# EAGLE design PiHatV2 (EAGLE 9.6.2)
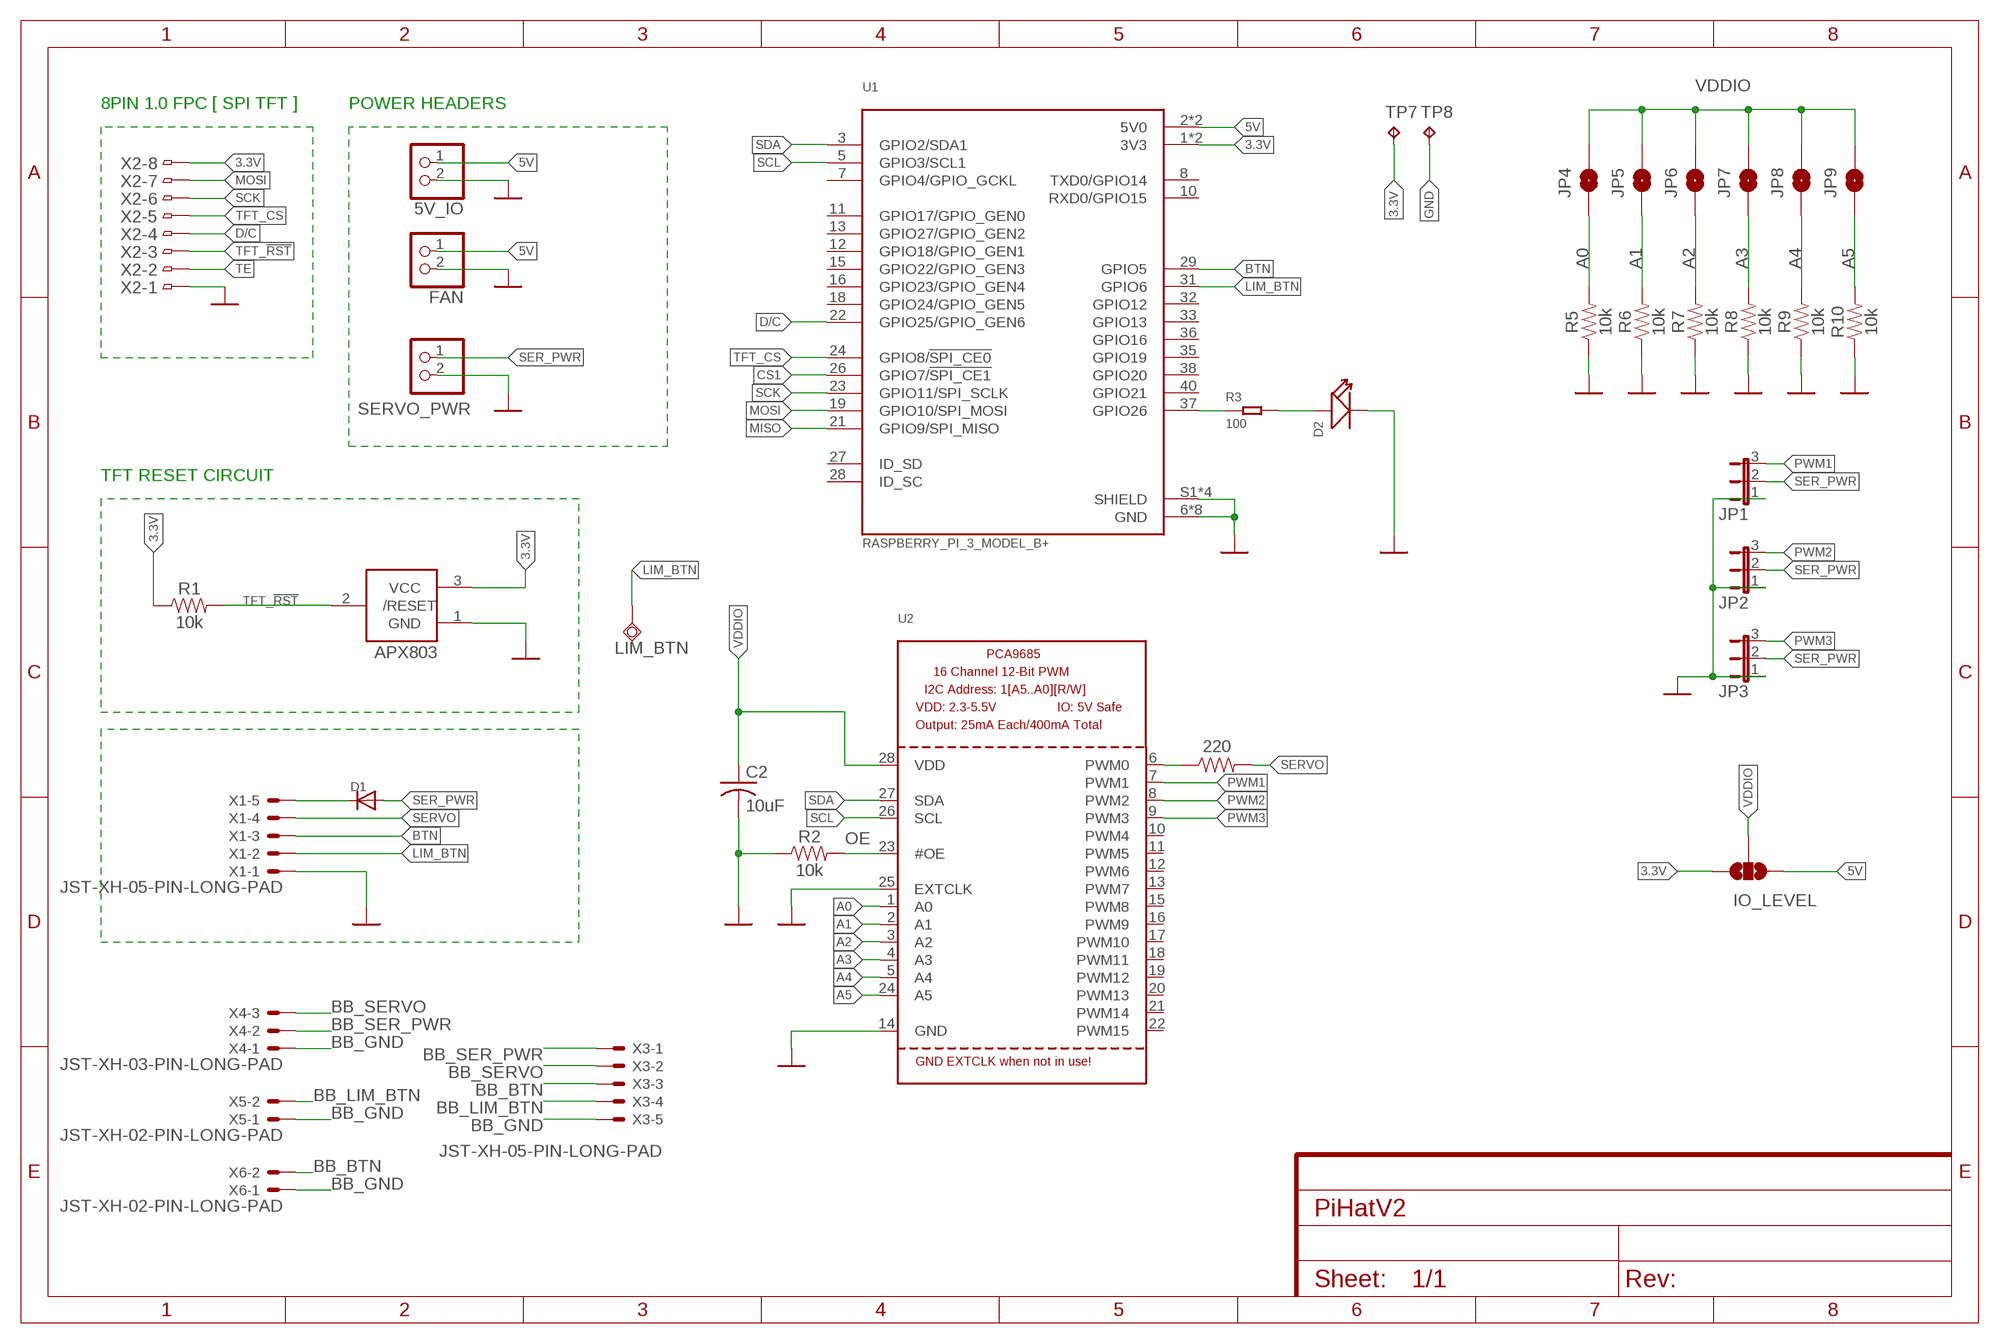
[diagram p0: schematic, sheet 1]

## Parts
5V_IO  ONBOARDCONTROLINTERFACE_LED-BADGE_SCHEMATIC_ADAFRUIT_JST_2PIN-SMT-RA  [ONBOARDCONTROLINTERFACE_LED-BADGE_SCHEMATIC_ADAFRUIT_JST-PH-2-SMT-RA]
APX803  ADAFRUIT_AXP083-SAG  [ADAFRUIT_SOT23]
C2  10uF  C-USC0805K  [C0805K]
D1  DIODESMA  [SMADIODE]
D2  BLUE-0603  SMD-LED-CLEAR-BLUE(0603)  [LED-0603]
FAN  ONBOARDCONTROLINTERFACE_LED-BADGE_SCHEMATIC_ADAFRUIT_JST_2PIN-SMT-RA  [ONBOARDCONTROLINTERFACE_LED-BADGE_SCHEMATIC_ADAFRUIT_JST-PH-2-SMT-RA]
IO_LEVEL  JUMPER-SMT_3_NO_NO-SILK  [SMT-JUMPER_3_NO_NO-SILK]
JP1  LED-BADGE_SCHEMATIC_JUMPER_JP2E  [LED-BADGE_SCHEMATIC_JUMPER_JP2]
JP2  LED-BADGE_SCHEMATIC_JUMPER_JP2E  [LED-BADGE_SCHEMATIC_JUMPER_JP2]
JP3  LED-BADGE_SCHEMATIC_JUMPER_JP2E  [LED-BADGE_SCHEMATIC_JUMPER_JP2]
JP4  JUMPER-SMT_2_NO_NO-SILK  [SMT-JUMPER_2_NO_NO-SILK]
JP5  JUMPER-SMT_2_NO_NO-SILK  [SMT-JUMPER_2_NO_NO-SILK]
JP6  JUMPER-SMT_2_NO_NO-SILK  [SMT-JUMPER_2_NO_NO-SILK]
JP7  JUMPER-SMT_2_NO_NO-SILK  [SMT-JUMPER_2_NO_NO-SILK]
JP8  JUMPER-SMT_2_NO_NO-SILK  [SMT-JUMPER_2_NO_NO-SILK]
JP9  JUMPER-SMT_2_NO_NO-SILK  [SMT-JUMPER_2_NO_NO-SILK]
LIM_BTN  TESTPAD_TPSQB1,27  [TESTPAD_B1,27]
R1  10k  ARDUINO_3V_TTL_INTERFACE_2_PI_SPARKFUN-RESISTORS_10KOHM-0603-1/10W-1%  [ARDUINO_3V_TTL_INTERFACE_2_PI_SPARKFUN-RESISTORS_0603:1]
R2  10k  ARDUINO_3V_TTL_INTERFACE_2_PI_SPARKFUN-RESISTORS_10KOHM-0603-1/10W-1%  [ARDUINO_3V_TTL_INTERFACE_2_PI_SPARKFUN-RESISTORS_0603:1]
R3  100  SMD-RES-1K-5%-1/8W(0805)  [R0805]
R4  220  ARDUINO_3V_TTL_INTERFACE_2_PI_SPARKFUN-RESISTORS_10KOHM-0603-1/10W-1%  [ARDUINO_3V_TTL_INTERFACE_2_PI_SPARKFUN-RESISTORS_0603:1]
R5  10k  ARDUINO_3V_TTL_INTERFACE_2_PI_SPARKFUN-RESISTORS_10KOHM-0603-1/10W-1%  [ARDUINO_3V_TTL_INTERFACE_2_PI_SPARKFUN-RESISTORS_0603:1]
R6  10k  ARDUINO_3V_TTL_INTERFACE_2_PI_SPARKFUN-RESISTORS_10KOHM-0603-1/10W-1%  [ARDUINO_3V_TTL_INTERFACE_2_PI_SPARKFUN-RESISTORS_0603:1]
R7  10k  ARDUINO_3V_TTL_INTERFACE_2_PI_SPARKFUN-RESISTORS_10KOHM-0603-1/10W-1%  [ARDUINO_3V_TTL_INTERFACE_2_PI_SPARKFUN-RESISTORS_0603:1]
R8  10k  ARDUINO_3V_TTL_INTERFACE_2_PI_SPARKFUN-RESISTORS_10KOHM-0603-1/10W-1%  [ARDUINO_3V_TTL_INTERFACE_2_PI_SPARKFUN-RESISTORS_0603:1]
R9  10k  ARDUINO_3V_TTL_INTERFACE_2_PI_SPARKFUN-RESISTORS_10KOHM-0603-1/10W-1%  [ARDUINO_3V_TTL_INTERFACE_2_PI_SPARKFUN-RESISTORS_0603:1]
R10  10k  ARDUINO_3V_TTL_INTERFACE_2_PI_SPARKFUN-RESISTORS_10KOHM-0603-1/10W-1%  [ARDUINO_3V_TTL_INTERFACE_2_PI_SPARKFUN-RESISTORS_0603:1]
SERVO_PWR  ONBOARDCONTROLINTERFACE_LED-BADGE_SCHEMATIC_ADAFRUIT_JST_2PIN-SMT-RA  [ONBOARDCONTROLINTERFACE_LED-BADGE_SCHEMATIC_ADAFRUIT_JST-PH-2-SMT-RA]
TP7  TPB2,54  [B2,54]
TP8  TPB2,54  [B2,54]
U1  RASPBERRY_PI_3_MODEL_B+  [MODULE_RASPBERRY_PI_3_MODEL_B+]
U2  PCA9685  [TSSOP28]
X1  JST-XH-05-PIN-LONG-PAD  [JST-XH-05-PACKAGE-LONG-PAD]
X2  SCREENBREAKOUT_SCREENBREAKOUT_LEDMATRIXFPCCONNECTOR_CON-HIROSE_FH12-08S-1SH  [SCREENBREAKOUT_SCREENBREAKOUT_LEDMATRIXFPCCONNECTOR_CON-HIROSE_FH12-08S-1SH]
X3  JST-XH-05-PIN-LONG-PAD  [JST-XH-05-PACKAGE-LONG-PAD]
X4  JST-XH-03-PIN-LONG-PAD  [JST-XH-03-PACKAGE-LONG-PAD]
X5  JST-XH-02-PIN-LONG-PAD  [JST-XH-02-PACKAGE-LONG-PAD]
X6  JST-XH-02-PIN-LONG-PAD  [JST-XH-02-PACKAGE-LONG-PAD]

## Nets
3.3V: APX803.3(VCC) IO_LEVEL.3 R1.1 TP7.TP U1.1(3V3) U1.17(3V3) X2.8
5V: 5V_IO.1 FAN.1 IO_LEVEL.1 U1.2(5V0) U1.4(5V0)
A0: JP4.1 R5.2 U2.1(A0)
A1: JP5.1 R6.2 U2.2(A1)
A2: JP6.1 R7.2 U2.3(A2)
A3: JP7.1 R8.2 U2.4(A3)
A4: JP8.1 R9.2 U2.5(A4)
A5: JP9.1 R10.2 U2.24(A5)
BB_BTN: X3.3 X6.2
BB_GND: X3.5 X4.1 X5.1 X6.1
BB_LIM_BTN: X3.4 X5.2
BB_SER_PWR: X3.1 X4.2
BB_SERVO: X3.2 X4.3
BTN: U1.29(GPIO5) X1.3
CS1: U1.26(GPIO7/!SPI_CE1!)
D/C: U1.22(GPIO25/GPIO_GEN6) X2.4
GND: 5V_IO.2 APX803.1(GND) C2.2 D2.- FAN.2 JP1.1 JP2.1 JP3.1 R2.1 R5.1 R6.1 R7.1 R8.1 R9.1 R10.1 SERVO_PWR.2 TP8.TP U1.6(GND) U1.9(GND) U1.14(GND) U1.20(GND) U1.25(GND) U1.30(GND) U1.34(GND) U1.39(GND) U1.S1(SHIELD) U1.S2(SHIELD) U1.S3(SHIELD) U1.S4(SHIELD) U2.14(GND) U2.25(EXTCLK) X1.1 X2.1 ; supply symbol labelled 3-5-PIN-SMD_GND
LIM_BTN: LIM_BTN.TP U1.31(GPIO6) X1.2
MISO: U1.21(GPIO9/SPI_MISO)
MOSI: U1.19(GPIO10/SPI_MOSI) X2.7
N$5: R4.1 U2.6(PWM0)
N$6: D1.C X1.5
N$9: R3.1 U1.37(GPIO26)
N$10: D2.+ R3.2
OE: R2.2 U2.23(#OE)
PWM1: JP1.3 U2.7(PWM1)
PWM2: JP2.3 U2.8(PWM2)
PWM3: JP3.3 U2.9(PWM3)
SCK: U1.23(GPIO11/SPI_SCLK) X2.6
SCL: U1.5(GPIO3/SCL1) U2.26(SCL)
SDA: U1.3(GPIO2/SDA1) U2.27(SDA)
SER_PWR: D1.A JP1.2 JP2.2 JP3.2 SERVO_PWR.1
SERVO: R4.2 X1.4
TE: X2.2
TFT_!RST: APX803.2(/RESET) R1.2 X2.3
TFT_CS: U1.24(GPIO8/!SPI_CE0!) X2.5
VDDIO: C2.1 IO_LEVEL.2 JP4.2 JP5.2 JP6.2 JP7.2 JP8.2 JP9.2 U2.28(VDD)
Unconnected: U1.7(GPIO4/GPIO_GCKL) U1.8(TXD0/GPIO14) U1.10(RXD0/GPIO15) U1.11(GPIO17/GPIO_GEN0) U1.12(GPIO18/GPIO_GEN1) U1.13(GPIO27/GPIO_GEN2) U1.15(GPIO22/GPIO_GEN3) U1.16(GPIO23/GPIO_GEN4) U1.18(GPIO24/GPIO_GEN5) U1.27(ID_SD) U1.28(ID_SC) U1.32(GPIO12) U1.33(GPIO13) U1.35(GPIO19) U1.36(GPIO16) U1.38(GPIO20) U1.40(GPIO21) U2.10(PWM4) U2.11(PWM5) U2.12(PWM6) U2.13(PWM7) U2.15(PWM8) U2.16(PWM9) U2.17(PWM10) U2.18(PWM11) U2.19(PWM12) U2.20(PWM13) U2.21(PWM14) U2.22(PWM15)

## Notes on the sheet
- 8PIN 1.0 FPC [ SPI TFT ] | POWER HEADERS
- TFT RESET CIRCUIT

## Library data of the parts
5V_IO FAN SERVO_PWR = PiHat:ONBOARDCONTROLINTERFACE_LED-BADGE_SCHEMATIC_ADAFRUIT_JST_2PIN: JST 2-Pin Connectors of various flavors SMT-RA (S2B-PH-SM4) 4UConnector #17311 SMT (B2B-PH-SM4) THM-RA (S2B-PH) THM (B2B-PH)
APX803 = PiHat:ADAFRUIT_AXP083
C2 = adafruit:C-US: CAPACITOR, American symbol
D1 = adafruit:DIODE: Diode SMADIODE - SMA Surface Mount Package 20V 1A Schottky Diode Digikey: 641-1014-6-ND DO-1N4148 - Through Hole Small Current Diode SOD-123 20V 1 A (.5mV Vf) Schottky Diode - Digikey: MBRX120TPMSCT-ND SOD-323 10V 570mA (.38mV Vf, 3ns) Schottky Diode - Digikey: ZLLS410CT-ND SOD-523 30V 30mA Schottky Diode (RB751S-40TE61) - Digikey: RB751S-40TE61CT-ND SOT23-R/W - SOT23 Package (R = Solder Paste/Reflow Ovens, W = Hand-Soldering) BAT54Film 40V 300mA - Digikey: 497-7162-1-ND
D2 = Seeed-LED:SMD-LED-CLEAR-BLUE(0603): 304090045; MPN: 19-217-BHC-ZL1M2RY-3T
IO_LEVEL = SparkFun-Jumpers:JUMPER-SMT_3_NO: Normally open jumper This jumper has three pads in close proximity to each other. Apply solder to close the connection(s).
JP1-JP3 = FeatherWing:LED-BADGE_SCHEMATIC_JUMPER_JP2E: JUMPER
JP4-JP9 = SparkFun-Jumpers:JUMPER-SMT_2_NO: Normally open jumper This jumper has two pads in close proximity to each other. Apply solder to close the connection. Round pads are easier to solder for beginners, but are a lot larger. SparkFun Product that uses the round pads: SparkFun EL Sequencer <https://www.sparkfun.com/products/12781>
LIM_BTN = ARDUINO_3V_TTL_INTERFACE_2_PI:TESTPAD_TPSQ: Test pad
R1 R2 R5-R10 = PiHat:ARDUINO_3V_TTL_INTERFACE_2_PI_SPARKFUN-RESISTORS_10KOHM: 10kΩ resistor A resistor is a passive two-terminal electrical component that implements electrical resistance as a circuit element. Resistors act to reduce current flow, and, at the same time, act to lower voltage levels within circuits. - Wikipedia; PROD_ID: RES-00824
R3 = Seeed-Resistor:SMD-RES-1K-5%-1/8W(0805): 301010311; MPN: RC0805JR-071KL; VALUE: 1K
R4 = PiHat:ARDUINO_3V_TTL_INTERFACE_2_PI_SPARKFUN-RESISTORS_10KOHM: 10kΩ resistor A resistor is a passive two-terminal electrical component that implements electrical resistance as a circuit element. Resistors act to reduce current flow, and, at the same time, act to lower voltage levels within circuits. - Wikipedia; PROD_ID: RES-00824; VALUE: 10k
TP7 TP8 = testpad:TP: Test pad
U1 = RASPBERRY_PI_3_MODEL_B_:RASPBERRY_PI_3_MODEL_B+: BCM2835 Raspberry Pi Model B+ - ARM11, VideoCore MPU Embedded Evaluation Board; AVAILABILITY: Unavailable; DESCRIPTION: BCM2837B0 Raspberry Pi 3 Model B+ - ARM® Cortex®-A53, VideoCore MPU Embedded Evaluation Board; MF: Raspberry Pi; MP: RASPBERRY PI 3 MODEL B+; PACKAGE: None; PRICE: None
U2 = adafruit:PCA9685: PCA9685 - 16 Channel 12-Bit I2C PWM Controller 5.0V tolerant 16 channel, 12-bit I2C PWM controller with 25mA per output (max. 400mA total) Digikey: 568-5931-1-ND
X1 X3 = Rembrandt Electronics - JST XH Connectors v1-0:JST-XH-05-PIN: JST XH Connector 2 Pin Wire to board connector. Pitch: 2,54 mm, (0.100") Number of pins: 5 Created by Rembrandt Electronics www.rembrandtelectronics.com
X2 = PiHat:SCREENBREAKOUT_SCREENBREAKOUT_LEDMATRIXFPCCONNECTOR_CON-HIROSE_FH12-08S-1S: 1mm Pitch Connectors For FPC/FFC Source: Data sheet <http://www.hirose.co.jp/cataloge_hp/e58605370.pdf>; OC_FARNELL: unknown; OC_NEWARK: unknown
X4 = Rembrandt Electronics - JST XH Connectors v1-0:JST-XH-03-PIN: JST XH Connector 2 Pin Wire to board connector. Pitch: 2,54 mm, (0.100") Number of pins: 3 Created by Rembrandt Electronics www.rembrandtelectronics.com
X5 X6 = Rembrandt Electronics - JST XH Connectors v1-0:JST-XH-02-PIN: JST XH Connector 2 Pin Wire to board connector. Pitch: 2,54 mm, (0.100") Number of pins: 2 Created by Rembrandt Electronics www.rembrandtelectronics.com

## Board
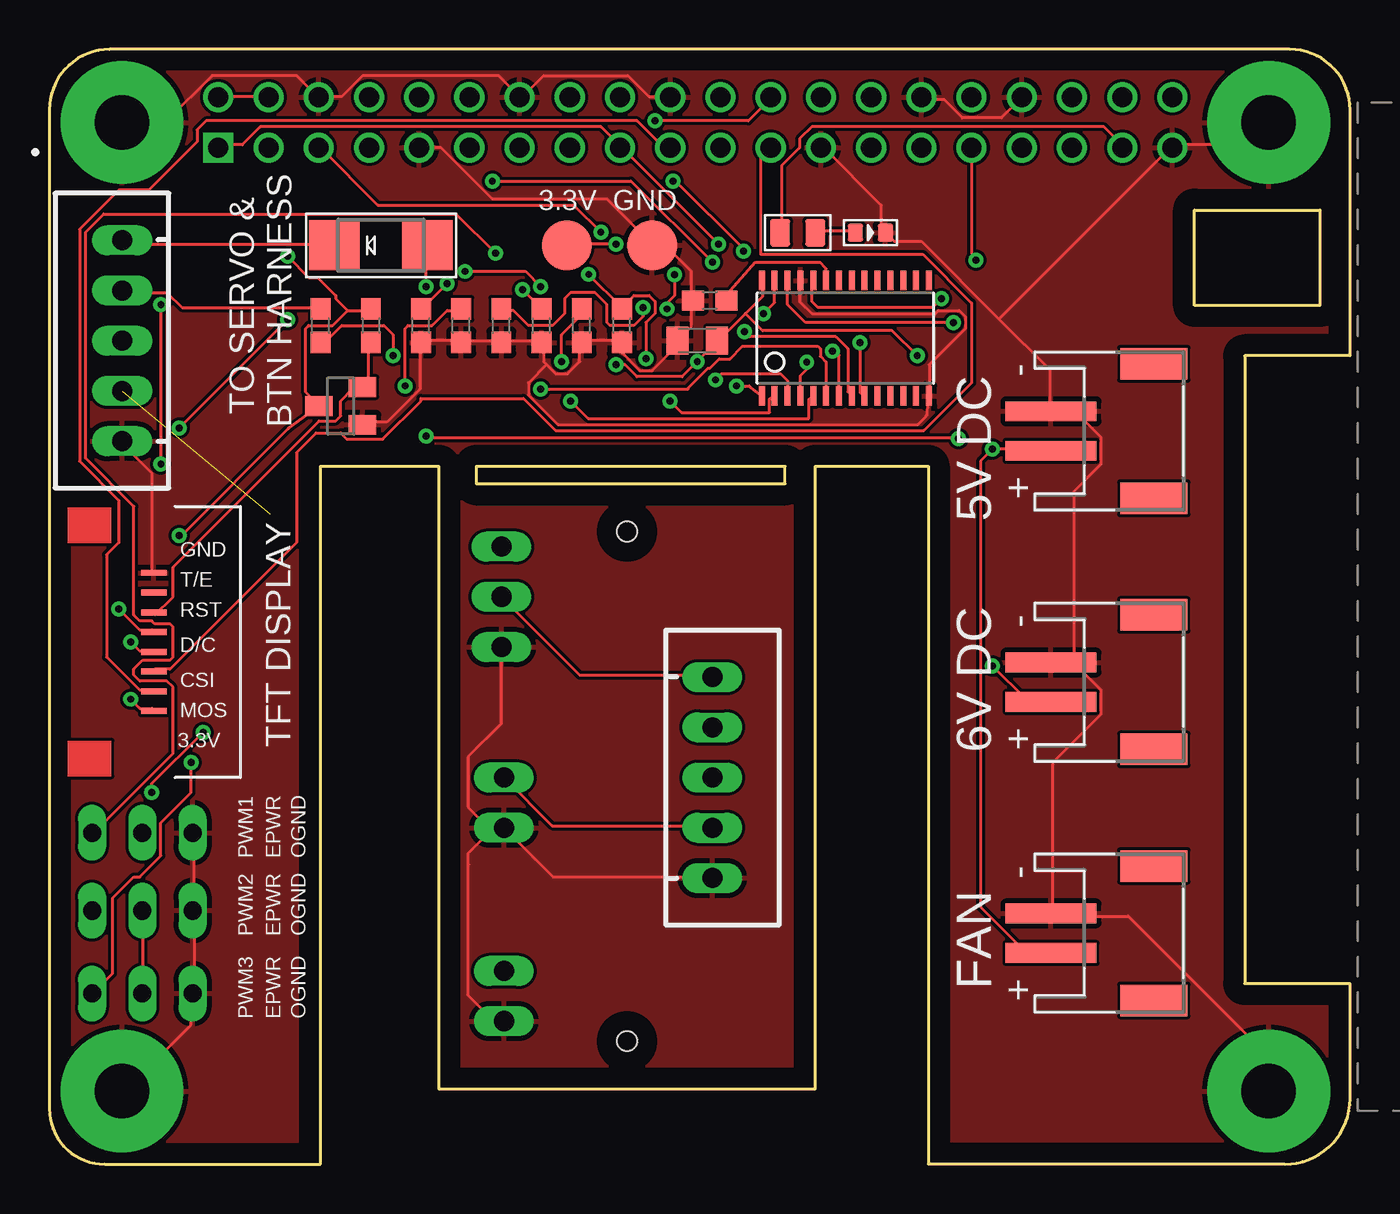
[diagram p1: board, top side]
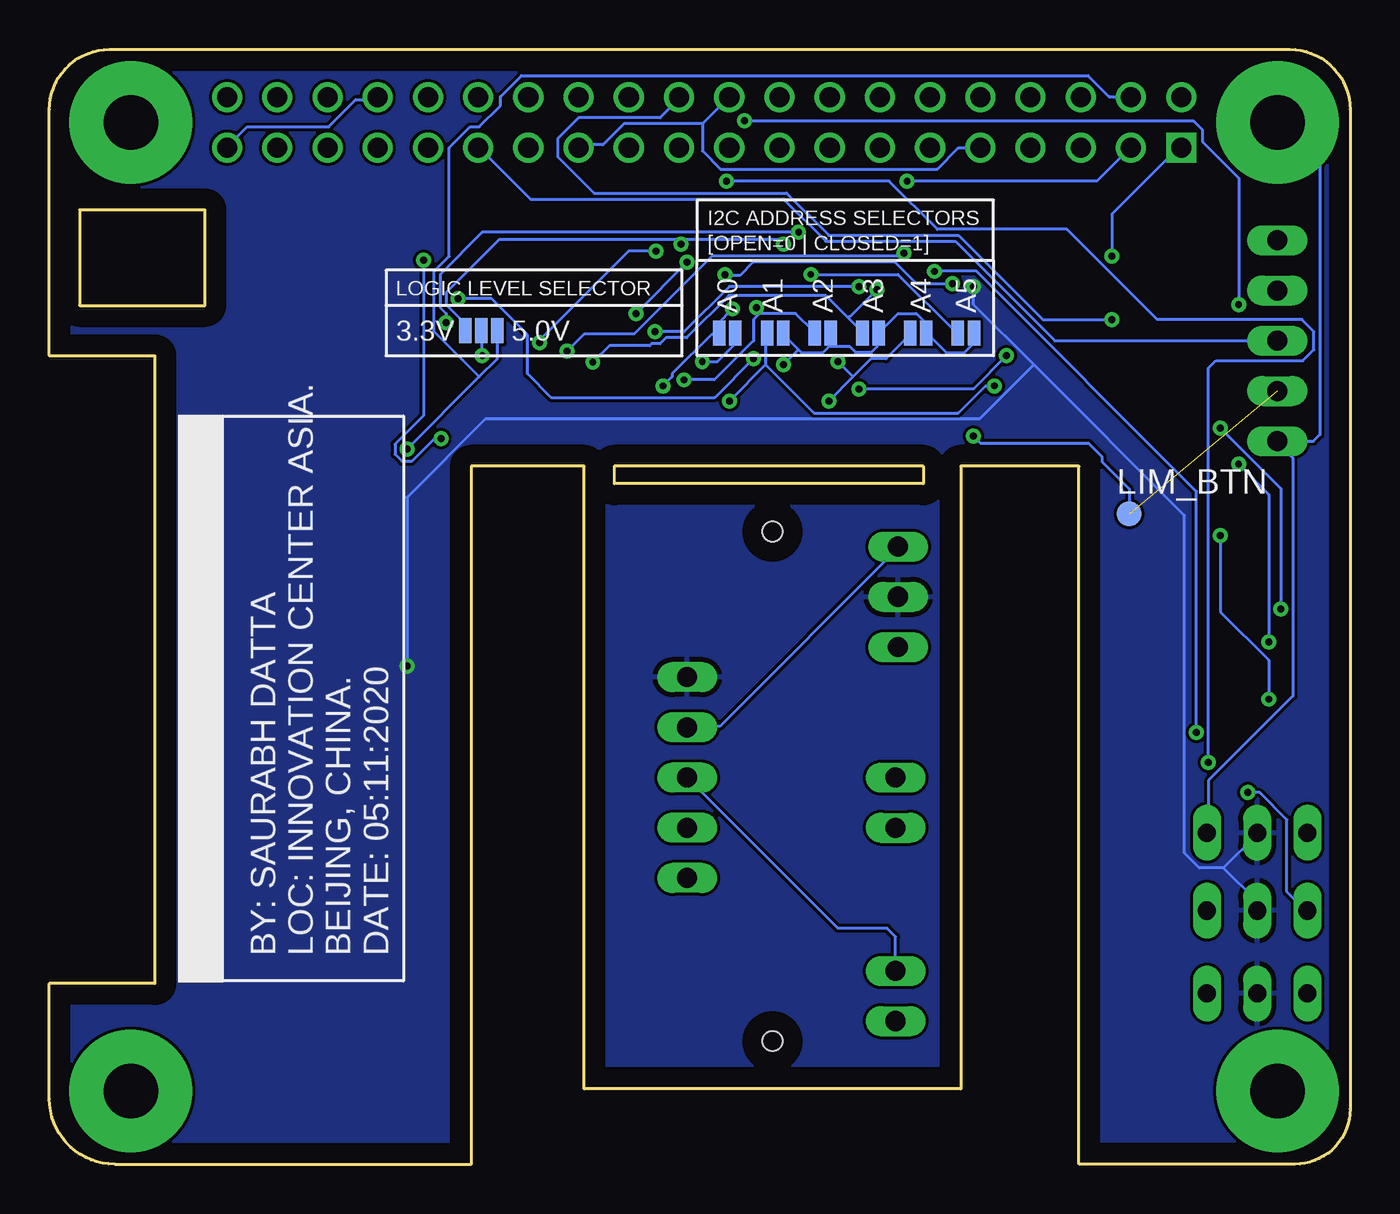
[diagram p2: board, bottom side, seen from below]

Size 65.79 x 56.39 mm. Coordinates in mm from the lower left corner, seen from the top.
Outline: 0,2.79 arc90 2.79,0 13.72,0 13.72,35.31 19.69,35.31 19.69,3.81 38.73,3.81 38.73,35.31 44.45,35.31 44.45,0 62.48,0 arc90 65.79,3.3 65.79,9.14 60.45,9.14 60.45,40.89 65.79,40.89 65.79,53.34 arc90 62.74,56.39 3.05,56.39 arc90 0,53.34 0,2.79
Outline: 57.91,48.26 64.26,48.26 64.26,43.43 57.91,43.43 57.91,48.26
Outline: 21.59,35.31 21.59,34.42 37.21,34.42 37.21,35.31 21.59,35.31
Copper layers (1*16): Top 0.035mm / dielectric 1.5mm / Bottom 0.035mm
Design rules "default *": minimum track width 6mil, minimum drill 0.35mm, track to track 6mil, track to pad 6mil, pad to pad 6mil, via to via 6mil, smd to smd 6mil, copper to edge 40mil, drill to drill 6mil, minimum pad ring 10mil, minimum via ring 8mil, stop-mask expansion 4mil, vias tented up to drill 0.35mm, thermal gap 10mil
Holes 1 mm at 29.21,32 29.21,6.22

### Footprints (pad centres in the part's own frame; a part is rotated, then mirrored left to right if it is on the bottom)
ONBOARDCONTROLINTERFACE_LED-BADGE_SCHEMATIC_ADAFRUIT_JST-PH-2-SMT-RA = smd 1 x 4.6: 1 1,-3.7; 2 -1,-3.7 | smd 1.6 x 3.4: NC1 -3.4,1.5; NC2 3.4,1.5
ADAFRUIT_SOT23 = smd 1 x 1.4: 1 -0.95,-1.1; 2 0.95,-1.1; 3 0,1.1
C0805K = smd 1.1 x 1.4: 1 -1,0; 2 1,0
SMADIODE = smd 2.54 x 2.54: A 2.349,0; C -2.349,0
LED-0603 = smd 0.762 x 0.889: + -0.762,0; - 0.762,0
SMT-JUMPER_3_NO_NO-SILK = smd 0.635 x 1.27: 1 -0.813,0; 2 0,0; 3 0.813,0
LED-BADGE_SCHEMATIC_JUMPER_JP2 = drill 0.914 long: 1 -2.54,0; 2 0,0; 3 2.54,0
SMT-JUMPER_2_NO_NO-SILK = smd 0.635 x 1.27: 1 -0.406,0; 2 0.406,0
TESTPAD_B1,27 = smd 1.27 x 1.27: TP 0,0
ARDUINO_3V_TTL_INTERFACE_2_PI_SPARKFUN-RESISTORS_0603:1 = smd 1.1 x 1: 1 -0.85,0; 2 0.85,0
R0805 = smd 1.397 x 1.016: 1 0,0.889; 2 0,-0.889
B2,54 = smd 2.54 x 2.54: TP 0,0
MODULE_RASPBERRY_PI_3_MODEL_B+ = drill 1.016 square: 1 -34.13,23.23 | drill 1.016: 2 -34.13,25.77; 3 -31.59,23.23; 4 -31.59,25.77; 5 -29.05,23.23; 6 -29.05,25.77; 7 -26.51,23.23; 8 -26.51,25.77; 9 -23.97,23.23; 10 -23.97,25.77; 11 -21.43,23.23; 12 -21.43,25.77; 13 -18.89,23.23; 14 -18.89,25.77; 15 -16.35,23.23; 16 -16.35,25.77; 17 -13.81,23.23; 18 -13.81,25.77; 19 -11.27,23.23; 20 -11.27,25.77; 21 -8.73,23.23; 22 -8.73,25.77; 23 -6.19,23.23; 24 -6.19,25.77; 25 -3.65,23.23; 26 -3.65,25.77; 27 -1.11,23.23; 28 -1.11,25.77; 29 1.43,23.23; 30 1.43,25.77; 31 3.97,23.23; 32 3.97,25.77; 33 6.51,23.23; 34 6.51,25.77; 35 9.05,23.23; 36 9.05,25.77; 37 11.59,23.23; 38 11.59,25.77; 39 14.13,23.23; 40 14.13,25.77 | drill 2.75 pad 6.2: S1 -39,24.5; S2 19,24.5; S3 19,-24.5; S4 -39,-24.5
TSSOP28 = smd 0.305 x 0.991: 1 -4.225,-2.918; 2 -3.575,-2.918; 3 -2.925,-2.918; 4 -2.275,-2.918; 5 -1.625,-2.918; 6 -0.975,-2.918; 7 -0.325,-2.918; 8 0.325,-2.918; 9 0.975,-2.918; 10 1.625,-2.918; 11 2.275,-2.918; 12 2.925,-2.918; 13 3.575,-2.918; 14 4.225,-2.918; 15 4.225,2.918; 16 3.575,2.918; 17 2.925,2.918; 18 2.275,2.918; 19 1.625,2.918; 20 0.975,2.918; 21 0.325,2.918; 22 -0.325,2.918; 23 -0.975,2.918; 24 -1.625,2.918; 25 -2.275,2.918; 26 -2.925,2.918; 27 -3.575,2.918; 28 -4.225,2.918
JST-XH-05-PACKAGE-LONG-PAD = drill 1.016 long: 1 -5.08,0; 2 -2.54,0; 3 0,0; 4 2.54,0; 5 5.08,0
SCREENBREAKOUT_SCREENBREAKOUT_LEDMATRIXFPCCONNECTOR_CON-HIROSE_FH12-08S-1SH = smd 0.3 x 1.3: 1 -3.5,3.25; 2 -2.5,3.25; 3 -1.5,3.25; 4 -0.5,3.25; 5 0.5,3.25; 6 1.5,3.25; 7 2.5,3.25; 8 3.5,3.25
JST-XH-03-PACKAGE-LONG-PAD = drill 1.016 long: 1 -2.54,0; 2 0,0; 3 2.54,0
JST-XH-02-PACKAGE-LONG-PAD = drill 1.016 long: 1 -1.27,0; 2 1.27,0

### Placement (x,y rotation side)
5V_IO  54.36,37.08 270 top
APX803  14.73,38.35 90 top
C2  32.77,41.66 180 top
D1  16.76,46.48 0 top
D2  41.53,47.12 0 top
FAN  54.36,11.68 270 top
IO_LEVEL  43.94,42.16 180 bottom
JP1  4.7,16.76 180 top
JP2  4.7,12.83 180 top
JP3  4.7,8.64 180 top
JP4  31.5,42.04 0 bottom
JP5  29.08,42.04 0 bottom
JP6  26.67,42.04 0 bottom
JP7  24.26,42.04 0 bottom
JP8  21.84,42.04 0 bottom
JP9  19.43,42.04 0 bottom
LIM_BTN  11.18,32.89 0 bottom
R1  16.26,42.42 270 top
R2  33.4,43.69 0 top
R3  37.85,47.12 90 top
R4  13.72,42.42 90 top
R5  18.8,42.42 90 top
R6  20.83,42.42 90 top
R7  22.86,42.42 90 top
R8  24.89,42.42 90 top
R9  26.92,42.42 90 top
R10  28.96,42.42 90 top
SERVO_PWR  54.36,24.38 270 top
TP7  26.16,46.48 0 top
TP8  30.48,46.48 0 top
U1  42.67,28.19 0 top
U2  40.26,41.78 0 top
X1  3.68,41.66 90 top
X2  2.03,26.42 270 top
X3  33.53,19.56 270 top
X4  22.86,28.7 90 top
X5  22.99,18.29 90 top
X6  22.99,8.51 90 top

### Tracks (layer width: path | path; a pad name or v marks a point on that pad's centre or on a via)
3.3V  (via drill 0.35)
  Top 0.152: 16.31,43.33 R1.1 16.15,43.18 15.09,43.18 | 15.09,43.18 14.33,42.42 13.11,42.42 12.95,42.27 12.95,39.06 13.56,38.46 APX803.3 12.08,37.2 6.68,31.8 v6.55,31.8 | v4.12,23.52 4.57,23.06 5.18,23.06 X2.8 | v33.83,46.53 28.96,51.41 U1.17 28.8,51.56 27.89,52.48 10.67,52.48 9.75,51.56 8.69,51.56 U1.1 | v28.65,46.53 26.21,46.53 TP7.TP | 15.09,43.18 14.48,43.79 14.48,43.94 13.56,44.86 13.11,44.86 v12.04,45.92
  Bottom 0.152: v4.12,23.52 4.12,25.5 6.55,27.94 v6.55,31.8 | IO_LEVEL.3 44.81,42.27 44.81,42.57 45.72,43.48 45.72,44.09 43.03,46.79 34.09,46.79 v33.83,46.53 33.58,46.79 28.91,46.79 v28.65,46.53 | v12.04,45.92 12.04,48.06 8.69,51.41 U1.1
5V  (via drill 0.35)
  Top 0.152: 50.75,10.72 FAN.1 | 49.38,10.72 50.6,10.72 FAN.1 | U1.2 8.69,54 10.97,54 U1.4 | 5V_IO.1 50.6,36.17 v47.7,36.17 47.09,35.56 47.09,13.01 49.38,10.72 | 49.38,10.72 FAN.1
  Bottom 0.152: IO_LEVEL.1 43.13,40.74 44.04,39.83 | v47.7,36.17 44.04,39.83 | 44.04,39.83 46.33,42.11 46.33,45.16 45.57,45.92 45.57,51.41 44.5,52.48 44.04,52.48 42.98,53.54 42.98,54 41.91,55.07 13.26,55.07 12.19,54 11.12,54 U1.4
A0  (via drill 0.35)
  Top 0.152: v34.75,39.37 35.39,39.37 U2.1 | v20.12,44.55 18.9,43.33 R5.2 | v31.62,45.01 31.62,43.94 31.24,43.56 v31.24,43.27
  Bottom 0.152: v34.75,39.37 34.29,39.83 34.29,39.98 32.31,41.96 32,41.96 | 32,41.96 JP4.1 | v20.12,44.55 21.95,44.55 23.01,45.62 30.2,45.62 30.86,44.96 31.57,44.96 v31.62,45.01 | v31.24,43.27 32,42.5 32,41.96
A1  (via drill 0.35)
  Top 0.152: v31.39,38.61 31.98,38.02 36.42,38.02 36.42,38.71 U2.2 | v17.98,39.37 17.98,42.27 18.14,42.42 19.35,42.42 20.12,43.18 20.73,43.18 R6.2
  Bottom 0.152: 29.57,40.44 v31.39,38.61 | 29.57,40.44 29.57,41.96 JP5.1 | v17.98,39.37 18.44,39.37 19.81,38 27.13,38 29.57,40.44
A2  (via drill 0.35)
  Top 0.152: v33.68,39.67 33.98,39.98 36.98,39.98 37.33,39.63 U2.3 37.33,38.76 | v30.02,43.33 30.02,42.88 29.57,42.42 28.35,42.42 28.19,42.57 28.19,43.48 27.58,44.09 26.37,44.09 26.06,43.79 26.06,43.03 25.45,42.42 24.23,42.42 23.47,43.18 22.86,43.18 R7.2
  Bottom 0.152: v33.68,39.67 32.16,39.67 30.17,41.66 30.17,42.72 29.87,43.03 29.72,43.03 | 29.72,43.03 28.04,43.03 27.13,42.11 JP6.1 | 29.72,43.03 v30.02,43.33
A3  (via drill 0.35)
  Top 0.152: v23.93,44.25 24.84,43.33 R8.2 | U2.4 37.98,39.89 38.3,40.21 v38.3,40.56
  Bottom 0.152: 25.45,42.88 24.69,42.11 JP7.1 | 25.45,42.88 26.52,43.94 31.42,43.94 33.55,41.81 34.6,41.81 34.9,41.51 35.33,41.51 35.43,41.4 37.46,41.4 v38.3,40.56 | v23.93,44.25 25.3,42.88 25.45,42.88
A4  (via drill 0.35)
  Top 0.152: v26.37,38.61 27.25,37.72 38.41,37.72 38.41,38.69 U2.5 | v25.91,40.59 25.91,41.96 26.82,42.88 26.82,43.18 R9.2
  Bottom 0.152: 25.15,39.83 24.23,40.74 23.47,40.74 22.25,41.96 JP8.1 | 25.15,39.83 v26.37,38.61 | 25.15,39.83 v25.91,40.59
A5  (via drill 0.35)
  Top 0.152: v45.11,43.79 44.65,43.33 38.86,43.33 38.56,43.64 38.56,44.51 U2.24 | v30.17,40.74 30.17,42.57 30.63,43.03 30.63,43.64 30.33,43.94 29.57,43.94 28.96,43.33 | 28.96,43.33 v27.28,45.01 | 28.96,43.33 R10.2
  Bottom 0.152: v45.11,43.79 43.43,43.79 41.6,41.96 41.6,39.98 40.39,38.76 32.16,38.76 v30.17,40.74 | v27.28,45.01 22.86,45.01 19.96,42.11 JP9.1
BB_BTN
  Bottom 0.152: X3.3 25.91,11.94 23.42,11.94 22.99,11.51 X6.2
BB_GND
  Top 0.152: X6.1 22.48,7.24 21.18,8.53 21.18,15.14 | 21.21,15.16 21.18,15.14 | X4.1 22.86,22.3 21.18,20.62 21.18,18.06 22.23,17.02 X5.1 | X3.5 33.53,14.53 25.48,14.53 X5.1 | 21.18,15.14 21.18,15.72 22.48,17.02 X5.1
  pour Top: 18.16,33.78 18.16,3.05 19.43,1.78 39.37,1.78 40.39,2.79 40.39,33.78 40.51,33.91 18.16,33.91
BB_LIM_BTN
  Top 0.152: X5.2 25.42,17.12 33.53,17.12 X3.4
BB_SER_PWR
  Top 0.152: X4.2 26.82,24.74 33.53,24.74 X3.1
  pour Bottom: 17.15,2.03 16.89,1.78 41.4,1.78 41.78,2.16 41.78,34.04 41.27,34.54 17.15,34.54
BB_SERVO
  Bottom 0.152: X3.2 33.53,22.15 31.88,22.15 22.86,31.17 X4.3
BTN
  Bottom 0.152: X1.3 14.94,41.66 19.96,46.69 26.52,46.69 28.65,48.82 41.45,48.82 44.04,51.41 U1.29
D/C  (via drill 0.35)
  Top 0.152: v3.5,28.09 4.57,27.03 5.18,27.03 X2.4 | v12.04,42.72 v6.55,37.24
  Bottom 0.152: v3.5,28.09 3.5,34.19 v6.55,37.24 | v12.04,42.72 15.54,42.72 19.81,46.99 26.37,46.99 28.5,49.12 38.25,49.12 40.08,50.95 40.08,51.87 39.01,52.93 34.9,52.93 33.98,53.85 U1.22
GND
  Top 0.152: 15.75,37.29 APX803.1 15.85,37.54 17.07,37.54 18.74,39.22 18.74,41.5 R5.1 18.9,41.66 20.73,41.66 R6.1 20.88,41.66 22.86,41.66 | 31.85,41.66 32,41.81 | 32,41.81 32.16,41.96 | 31.55,46.08 30.48,46.08 TP8.TP | JP1.1 7.31,16.66 7.31,12.85 JP2.1 7.31,12.7 7.31,8.74 JP3.1 7.16,8.59 7.16,7.06 3.81,3.71 U1.S4 | X2.1 5.18,29.92 5.18,34.95 3.66,36.47 X1.1 | U1.30 44.2,53.85 45.26,53.85 46.18,52.93 48.16,52.93 49.07,53.85 U1.34 | U1.S2 61.57,52.63 60.5,51.56 56.84,51.56 U1.39 56.69,51.41 48.03,42.75 | 32.16,41.96 32.16,42.21 | 32.16,41.96 C2.2 | 32,41.81 C2.2 | 31.55,46.08 32.46,45.16 32.46,43.61 32.47,43.61 | 32.47,43.61 R2.1 | 31.55,46.08 TP8.TP | U1.9 18.74,51.41 19.81,51.41 22.4,48.82 28.19,48.82 30.48,46.53 TP8.TP | U2.25 37.95,44.65 37.95,43.64 38.56,43.03 44.81,43.03 44.96,43.18 46.02,43.18 46.33,42.88 46.33,42.27 44.5,40.44 44.5,38.87 U2.14 44.46,38.84 44.35,37.85 43.92,37.41 25.73,37.41 24.23,38.91 24.23,39.52 25.15,40.44 | 22.86,41.66 24.84,41.66 R8.1 24.99,41.5 24.99,40.59 25.15,40.44 | 22.86,41.66 R7.1 | 25.15,40.44 25.6,39.98 26.21,39.98 26.82,40.59 26.82,41.5 R9.1 26.98,41.66 28.96,41.66 R10.1 28.96,41.05 29.87,40.13 30.48,40.13 31.7,41.35 31.7,41.66 C2.2 | 50.6,12.55 FAN.2 | 51.82,25.35 53.19,23.98 53.19,22.76 50.75,20.32 50.75,12.83 50.66,12.73 FAN.2 | 51.82,25.35 50.75,25.35 SERVO_PWR.2 51.82,25.35 | U1.25 39.17,51.41 42.06,48.51 42.06,47.35 D2.- 42.72,46.69 44.09,46.69 48.03,42.75 | U1.20 31.39,54 30.33,54 29.26,55.07 24.99,55.07 23.93,54 U1.14 23.77,54 22.71,55.07 15.85,55.07 14.78,54 13.72,54 U1.6 13.56,54 12.5,55.07 8.23,55.07 5.94,52.78 3.81,52.78 U1.S1
  Top 0.152: 48.03,42.75 50.6,40.18 50.6,38.15 5V_IO.2 50.75,38 51.97,38 53.19,36.78 53.19,35.41 51.82,34.04 51.82,25.35 | U1.S3 61.57,3.71 61.57,5.54 54.56,12.55 50.75,12.55 FAN.2 | C2.2 32.47,42.36 32.47,43.61
  Bottom 0.152: 3.81,3.71 U1.S4 | 7.24,8.59 JP3.1 | U1.S1 3.66,52.63 1.52,50.5 1.52,36.91 1.85,36.58 X1.1 3.66,36.47 2.9,35.71 2.9,23.67 7.16,19.41 7.16,16.82 JP1.1 | U1.34 49.23,53.85 50.29,53.85 51.66,52.48 55.78,52.48 56.69,51.56 U1.39 | 32.77,52.63 36.73,52.63 37.8,51.56 39.01,51.56 U1.25 | 32.77,52.63 31.55,53.85 U1.20 | 32.77,52.63 32.77,51.26 31.85,50.34 20.88,50.34 19.81,51.41 18.74,51.41 U1.9
  pour Top: -1.91,58.67 -1.91,2.03 2.41,-2.29 64.14,-2.29 66.55,0.13 66.55,56.26 64.26,58.55 63.5,59.31 -0.38,59.31 -1.27,59.31
LIM_BTN  (via drill 0.35)  (1 unrouted)
  Top 0.152: U1.31 46.64,46.07 46.86,45.85 v46.86,45.72 | v45.97,36.7 45.95,36.73 19.15,36.73 v19.05,36.83
  Bottom 0.152: v46.86,45.72 46.86,37.87 48.31,36.42 48.31,35.92 47.95,35.56 47.45,35.56 46.31,36.7 v45.97,36.7 | v19.05,36.83 18.69,36.47 13.23,36.47 12.55,35.79 12.55,35.54 11.18,34.16 LIM_BTN.TP
MOSI
  Top 0.152: X2.7 5.18,23.98 4.57,23.98 2.9,25.65 2.9,30.84 3.5,31.45 3.5,33.58 1.52,35.56 1.52,47.3 3.5,49.28 5.03,49.28 7.47,51.71 7.47,52.32 7.93,52.78 29.72,52.78 30.94,51.56 31.39,51.56 U1.19
N$5  (via drill 0.35)
  Top 0.152: 13.72,41.5 R4.1 13.72,41.66 14.02,41.66 14.78,42.42 16.92,42.42 17.37,41.96 v17.37,40.89 | v24.84,39.22 32.26,39.22 | 32.26,39.22 32.31,39.22 | 32.26,39.22 33.3,40.26 33.41,40.26 33.88,40.73 34.41,40.73 35.05,41.37 35.05,41.38 38.86,41.38 38.99,41.25 38.99,40.87 39.28,40.58 U2.6
  Bottom 0.152: v24.84,39.22 19.05,39.22 v17.37,40.89
N$6
  Top 0.152: D1.C 14.33,46.53 3.96,46.53 3.81,46.69 X1.5
N$9
  Top 0.152: 37.03,47.14 37.03,50.5 37.95,51.41 37.95,51.87 38.56,52.48 53.34,52.48 54.25,51.56 U1.37 | 37.03,47.14 37.03,46.84 R3.1 37.03,47.14
N$10
  Top 0.152: D2.+ 40.69,47.19 38.81,47.19 R3.2
OE
  Top 0.152: U2.23 39.28,45.3 38.96,45.62 35.71,45.62 34.25,43.96 R2.2
PWM1  (via drill 0.35)
  Top 0.152: v22.55,46.08 20.57,48.06 2.74,48.06 1.83,47.14 1.83,35.71 4.27,33.27 4.27,27.79 4.57,27.48 5.18,27.48 5.33,27.33 6.1,27.33 6.25,27.18 6.25,25.65 6.1,25.5 4.72,25.5 4.27,25.04 4.27,24.74 4.57,24.44 5.94,24.44 6.25,24.13 6.25,20.78 2.29,16.82 JP1.3 | U2.7 39.93,40.91 39.73,41.12 v39.6,41.12
  Bottom 0.152: 2.06,16.82 JP1.3 | v39.6,41.12 38.71,42.01 36.2,42.01 32.28,45.92 22.71,45.92 v22.55,46.08
PWM2  (via drill 0.35)
  Top 0.152: v35.15,42.11 35.41,41.86 39.78,41.86 40.39,41.25 40.39,39.07 U2.8 | v24.84,44.4 24.08,45.16 v21.03,45.16 | v7.77,21.84 5.18,19.25 v5.18,18.8
  Bottom 0.152: v35.15,42.11 33.68,42.11 31.39,44.4 v24.84,44.4 | v21.03,45.16 18.9,45.16 7.77,34.04 v7.77,21.84 | v5.18,18.8 4.57,18.8 3.2,17.42 3.2,13.77 2.29,12.85 JP2.3
PWM3  (via drill 0.35)
  Top 0.152: v41,41.55 41,39.02 U2.9 | v31.55,49.73 31.67,49.73 35.1,46.3 v35.1,46.18 | v7.16,20.32 7.16,18.8 5.64,17.27 5.64,15.6 4.57,14.53 4.27,14.53 3.2,13.46 3.2,9.65 2.29,8.74 JP3.3
  Bottom 0.152: v41,41.55 41,41.68 36.5,46.18 v35.1,46.18 | v31.55,49.73 23.32,49.73 20.88,47.3 14.33,47.3 9.75,42.72 2.44,42.72 1.83,42.11 1.83,41.2 2.39,40.64 6.78,40.64 7.16,40.26 v7.16,20.32
SCK
  Top 0.152: X2.6 5.33,25.04 6.1,25.04 12.5,31.45 12.5,35.99 13.49,36.98 14.73,36.98 15.04,36.67 16.86,36.67 18.8,38.61 18.8,38.73 23.98,38.73 25.6,37.11 44.22,37.11 46.63,39.52 46.63,43.56 44.17,46.03 35.97,46.03 35.97,50.95 36.42,51.41 U1.23
SCL  (via drill 0.35)
  Top 0.152: v45.72,42.57 38.25,42.57 37.34,43.48 U2.26 | v27.89,47.14 26.52,48.51 16.61,48.51 13.72,51.41 U1.5
  Bottom 0.152: v45.72,42.57 45.72,43.03 46.02,43.33 46.02,45.01 43.89,47.14 v27.89,47.14
SDA  (via drill 0.35)
  Top 0.152: v36.12,43.03 36.68,43.59 U2.27 | v33.53,45.62 29.41,49.73 v22.4,49.73
  Bottom 0.152: v33.53,45.62 v36.12,43.03 | v22.4,49.73 12.8,49.73 11.12,51.41 U1.3
SER_PWR  (via drill 0.35)
  Top 0.152: JP3.2 4.72,8.74 4.72,12.7 JP2.2 | v19.05,44.4 19.05,46.38 D1.A | v47.7,25.2 49.38,23.52 50.6,23.52 SERVO_PWR.1
  Bottom 0.152: v19.05,44.4 19.05,43.48 16,40.44 | 16,40.44 8.38,32.82 8.38,15.75 7.62,14.99 6.4,14.99 | 6.4,14.99 4.72,16.66 JP1.2 | 6.4,14.99 4.72,13.31 4.72,12.85 JP2.2 | v47.7,25.2 47.7,33.73 43.74,37.69 18.74,37.69 16,40.44
  pour Bottom: -3.3,58.67 -3.3,1.27 1.02,-3.05 1.14,-3.17 65.02,-3.17 67.69,-0.51 67.69,0.51 67.69,57.79 65.41,60.07 64.77,60.71 -0.64,60.71 -1.27,60.71
SERVO
  Top 0.152: R4.2 13.72,43.33 6.71,43.33 5.94,44.09 3.81,44.09 X1.4
TE
  Top 0.152: 5.33,28.96 X2.2
TFT_!RST
  Top 0.152: 15.9,39.27 APX803.2 | 15.75,39.27 APX803.2 | 16.15,39.67 15.85,39.37 APX803.2 | 16.15,39.67 16.15,41.5 R1.2 | 16.15,39.67 APX803.2 | 15.7,38.91 15.7,39.22 15.74,39.25 | 15.74,39.25 APX803.2 | X2.3 5.33,27.79 6.25,28.7 6.25,30.2 13.64,37.59 14.48,37.59 14.73,37.85 14.73,38.61 15.37,39.25 15.74,39.25
TFT_CS  (via drill 0.35)
  Top 0.152: v4.12,26.42 4.57,25.96 5.18,25.96 X2.5 | v5.64,43.48 v5.64,35.41 | v30.63,52.78 35.36,52.78 36.42,53.85 U1.24
  Bottom 0.152: v4.12,26.42 4.12,33.88 v5.64,35.41 | v5.64,43.48 5.64,49.89 7.47,51.71 7.47,52.32 7.93,52.78 v30.63,52.78
VDDIO  (via drill 0.35)
  Top 0.152: U2.28 36.07,44.67 36.07,43.89 35.2,43.03 | 33.83,41.66 35.2,43.03 | 33.83,41.66 v32.77,40.59 32,39.83 29.72,39.83 29.11,40.44 v28.65,40.44 | 33.83,41.66 C2.1 | v43.89,40.89 42.62,42.16 36.07,42.16 35.2,43.03
  Bottom 0.152: 31.09,42.11 JP4.2 31.09,41.5 32,40.59 v32.77,40.59 | 26.37,41.35 26.37,41.96 JP6.2 | 26.37,41.35 26.67,41.05 27.74,41.05 27.89,41.2 | 27.89,41.2 28.65,41.96 JP5.2 | JP9.2 19.05,41.96 19.05,41.5 19.51,41.05 20.42,41.05 21.34,41.96 JP8.2 21.49,42.11 21.49,42.57 21.95,43.03 22.86,43.03 JP7.2 23.93,41.96 23.93,41.35 24.23,41.05 24.99,41.05 25.3,41.35 26.37,41.35 | v43.89,40.89 43.89,42.11 IO_LEVEL.2 | v28.65,40.44 27.89,41.2

### Text on the board
tPlace: 3.3V | GND | TO SERVO & / BTN HARNESS | 5V DC | GND | T/E | RST | 6V DC | D/C | CSI | MOS | 3.3V | TFT DISPLAY | PWM1 | EPWR | OGND | FAN | PWM2 | EPWR | OGND | PWM3 | EPWR | OGND
bPlace: I2C ADDRESS SELECTORS | [OPEN=0 | CLOSED=1] | A5 | A4 | A3 | A2 | A1 | A0 | LOGIC LEVEL SELECTOR | 5.0V | 3.3V | BY: SAURABH DATTA / LOC: INNOVATION CENTER ASIA. / BEIJING, CHINA. / DATE: 05:11:2020